# EAGLE schematic qstp_q4 (EAGLE 9.6.2)
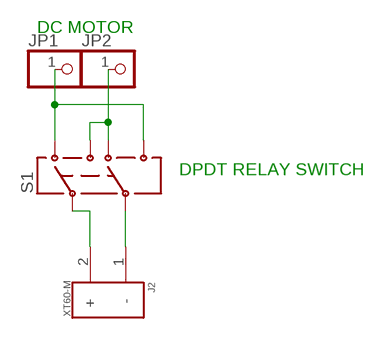
[diagram p0: schematic, sheet 1]

## Parts
J2  XT60-M  [AMASS_XT60-M]
JP1  PINHD-1X1  [1X01]
JP2  PINHD-1X1  [1X01]
S1  SWITCH-DPDTEG2211  [EG2211]

## Nets
N$1: J2.2(+) S1.P1
N$2: J2.1(-) S1.P2
N$3: JP2.1 S1.P1-TB S1.P2-TA
N$4: JP1.1 S1.P1-TA S1.P2-TB

## Notes on the sheet
- DC MOTOR
- DPDT RELAY SWITCH

## Library data of the parts
J2 = XT60-M:XT60-M: DC supply; XT60; male; PIN:2; for cable; soldered; 60A; 500V; AVAILABILITY: Unavailable; DESCRIPTION: Plug; DC supply; XT60; male; PIN: 2; for cable; soldered; 30A; 500V; MF: AMASS; MP: XT60-M; PACKAGE: Package; PRICE: None
JP1 JP2 = adafruit:PINHD-1X1: Pin header 1x1 for 0.1" spacing With round pins
S1 = SparkFun-Retired:SWITCH-DPDT: DPDT Version of the COM-00597